# Altium schematic sheet 05_Output Connectors.SchDoc
size A3; SheetNumber: 5; SheetTotal: 14
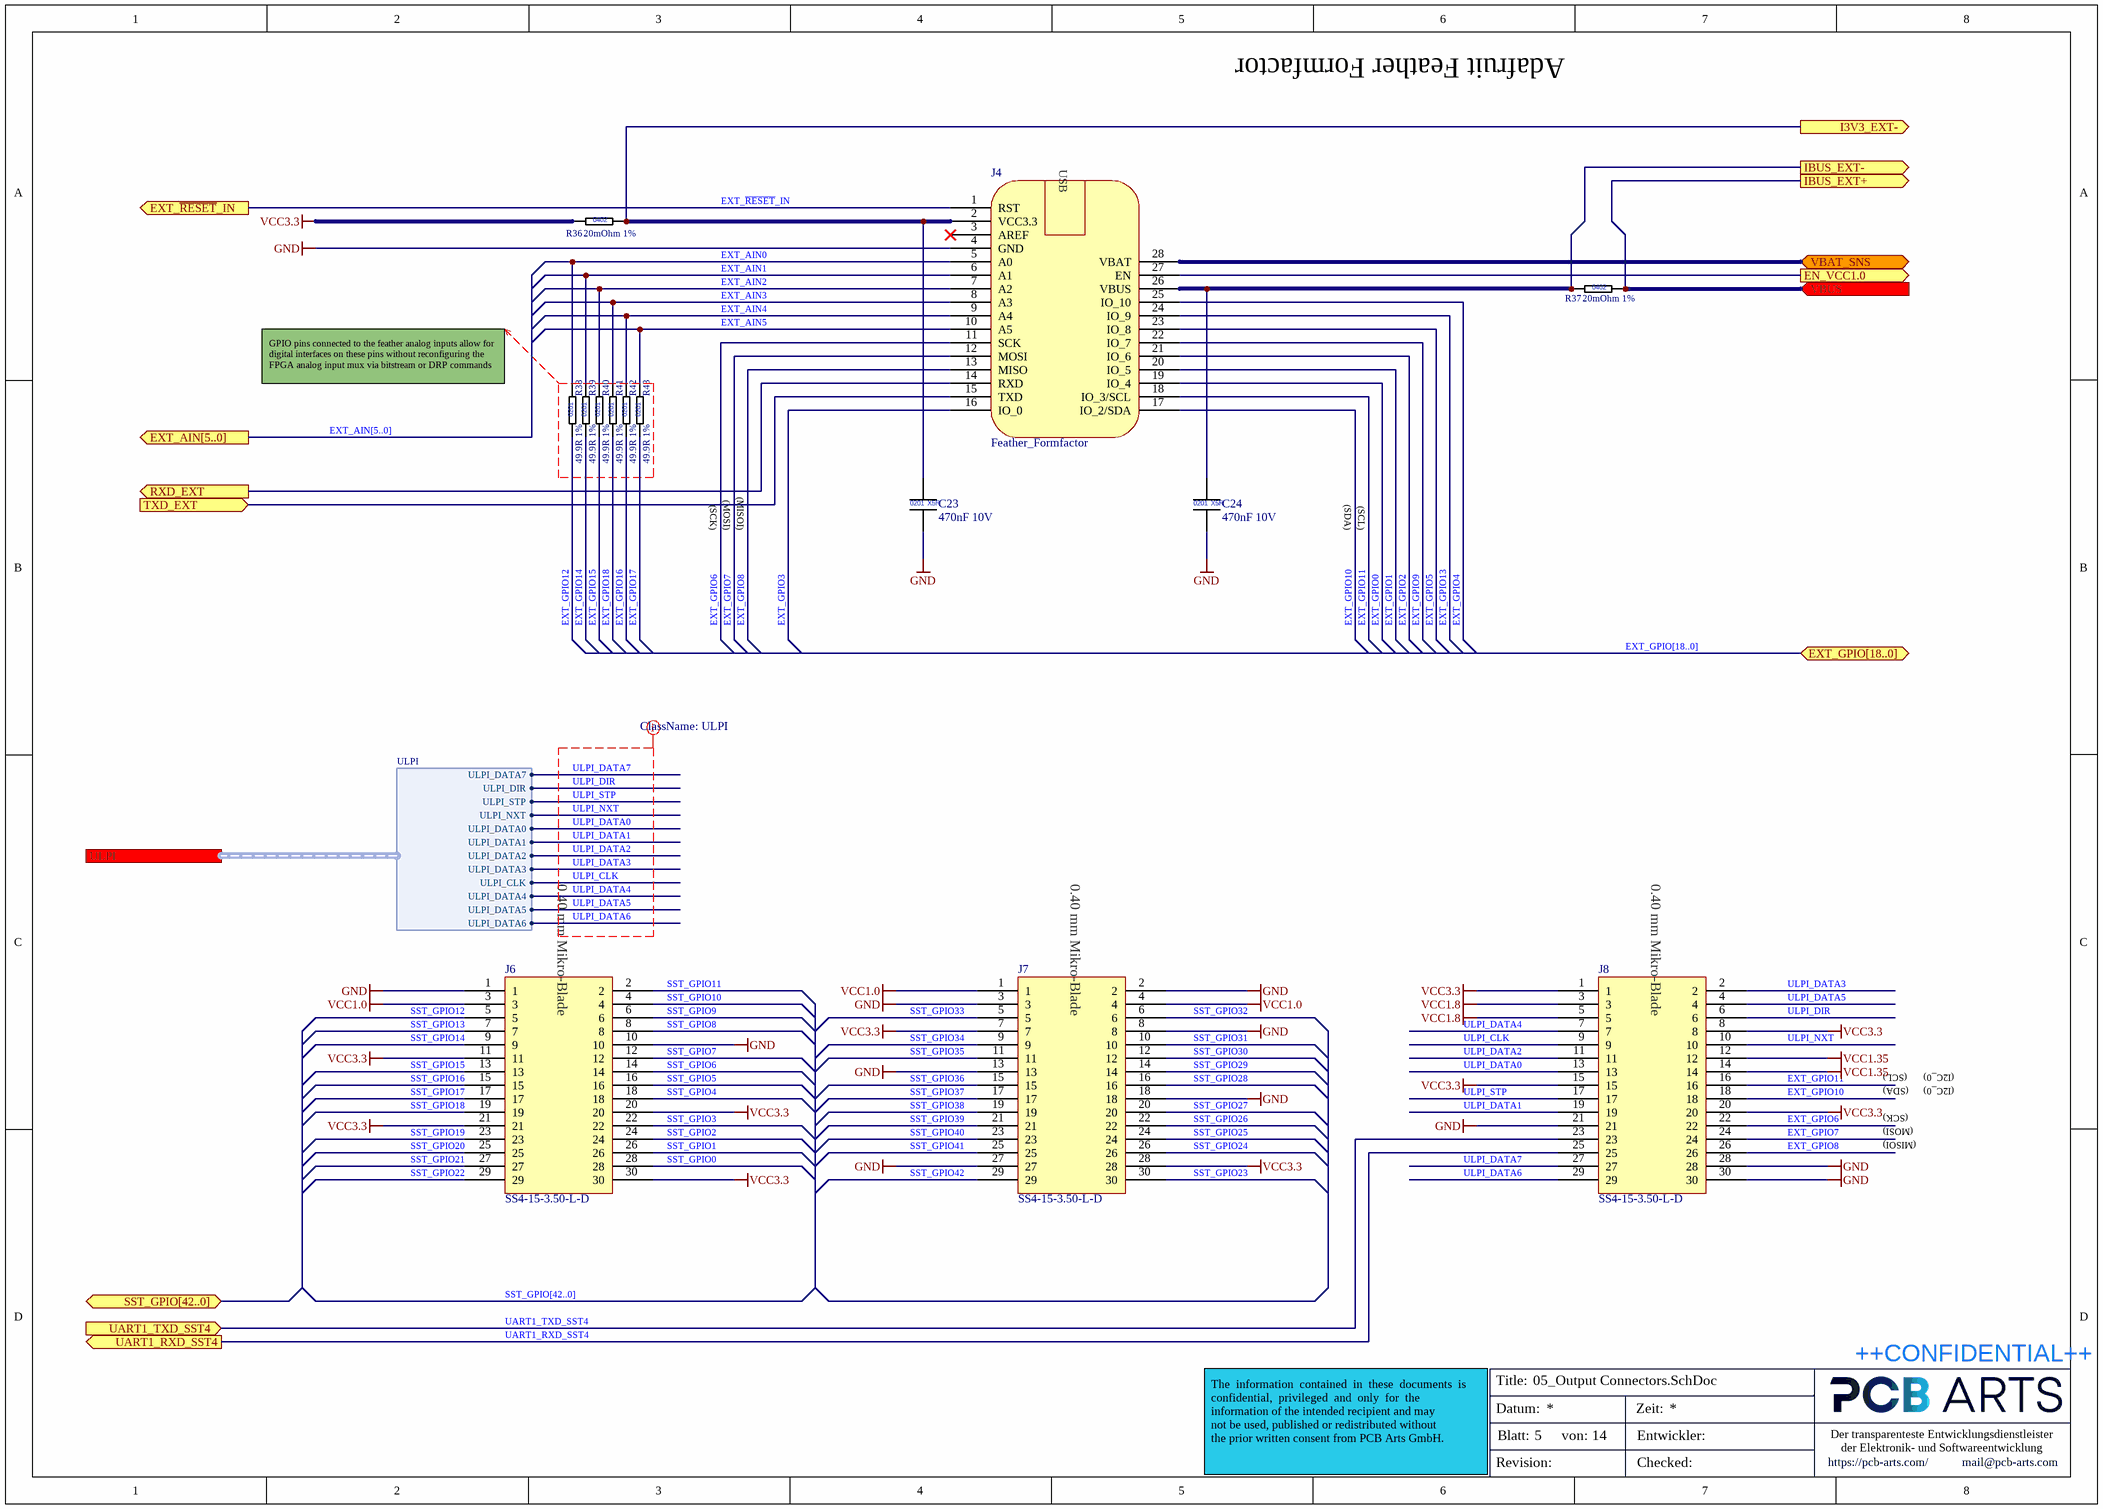
[diagram p0: 05_Output Connectors.SchDoc]

## Parts
C23  470nF 10V  [CAPC0603X03L]
C24  470nF 10V  [CAPC0603X03L]
J4  Feather_Formfactor  [Feather_FFC]  (no BOM)
J6  SS4-15-3.50-L-D  [SS4-15-3.50-L-D]
J7  SS4-15-3.50-L-D  [SS4-15-3.50-L-D]
J8  SS4-15-3.50-L-D  [SS4-15-3.50-L-D]
R36  20mOhm 1%  [RESC1005X04L]
R37  20mOhm 1%  [RESC1005X04L]
R38  49.9R 1%  [RESC0603X03L]
R39  49.9R 1%  [RESC0603X03L]
R40  49.9R 1%  [RESC0603X03L]
R41  49.9R 1%  [RESC0603X03L]
R42  49.9R 1%  [RESC0603X03L]
R43  49.9R 1%  [RESC0603X03L]

## Ports
EN_VCC1.0 (out), EXT_AIN[5..0] (out), EXT_GPIO[18..0] (bidir), EXT_~{RESET}_IN (out), I3V3_EXT- (out), IBUS_EXT+ (out), IBUS_EXT- (out), RXD_EXT (out), SST_GPIO[42..0] (bidir), TXD_EXT (in), UART1_RXD_SST4 (out), UART1_TXD_SST4 (in), ULPI (harness ULPI), VBAT_SNS (bidir), VBUS (in)

## Harnesses
ULPI: ULPI_DATA7, ULPI_DIR, ULPI_STP, ULPI_NXT, ULPI_DATA0, ULPI_DATA1, ULPI_DATA2, ULPI_DATA3, ULPI_CLK, ULPI_DATA4, ULPI_DATA5, ULPI_DATA6

## Nets
GND: C23.2 C24.2 J4.4(GND) J6.1 J6.10 J7.2 J7.3 J7.8 J7.13 J7.18 J7.27 J8.21 J8.28 J8.30
VCC1.0: J6.3 J7.1 J7.4
VCC1.8: J8.3 J8.5
VCC1.35: J8.12 J8.14
VCC3.3: J6.11 J6.20 J6.21 J6.30 J7.7 J7.28 J8.1 J8.8 J8.15 J8.20 R36.1
EN_VCC1.0: J4.27(EN) ; port EN_VCC1.0
EXT_AIN0: J4.5(A0) R38.2
EXT_AIN1: J4.6(A1) R39.2
EXT_AIN2: J4.7(A2) R40.2
EXT_AIN3: J4.8(A3) R41.2
EXT_AIN4: J4.9(A4) R42.2
EXT_AIN5: J4.10(A5) R43.2
EXT_GPIO0: J4.19(IO_4)
EXT_GPIO1: J4.20(IO_5)
EXT_GPIO2: J4.21(IO_6)
EXT_GPIO3: J4.16(IO_0)
EXT_GPIO4: J4.25(IO_10)
EXT_GPIO5: J4.23(IO_8)
EXT_GPIO6: J4.11(SCK) J8.22
EXT_GPIO7: J4.12(MOSI) J8.24
EXT_GPIO8: J4.13(MISO) J8.26
EXT_GPIO9: J4.22(IO_7)
EXT_GPIO10: J4.17(IO_2/SDA) J8.18
EXT_GPIO11: J4.18(IO_3/SCL) J8.16
EXT_GPIO12: R38.1
EXT_GPIO13: J4.24(IO_9)
EXT_GPIO14: R39.1
EXT_GPIO15: R40.1
EXT_GPIO16: R42.1
EXT_GPIO17: R43.1
EXT_GPIO18: R41.1
EXT_~{RESET}_IN: J4.1(RST) ; port EXT_~{RESET}_IN
I3V3_EXT-: C23.1 J4.2(VCC3.3) R36.2 ; port I3V3_EXT-
IBUS_EXT+: R37.2 ; port VBUS, port IBUS_EXT+
IBUS_EXT-: C24.1 J4.26(VBUS) R37.1 ; port IBUS_EXT-
RXD_EXT: J4.14(RXD) ; port RXD_EXT
SST_GPIO0: J6.28
SST_GPIO1: J6.26
SST_GPIO2: J6.24
SST_GPIO3: J6.22
SST_GPIO4: J6.18
SST_GPIO5: J6.16
SST_GPIO6: J6.14
SST_GPIO7: J6.12
SST_GPIO8: J6.8
SST_GPIO9: J6.6
SST_GPIO10: J6.4
SST_GPIO11: J6.2
SST_GPIO12: J6.5
SST_GPIO13: J6.7
SST_GPIO14: J6.9
SST_GPIO15: J6.13
SST_GPIO16: J6.15
SST_GPIO17: J6.17
SST_GPIO18: J6.19
SST_GPIO19: J6.23
SST_GPIO20: J6.25
SST_GPIO21: J6.27
SST_GPIO22: J6.29
SST_GPIO23: J7.30
SST_GPIO24: J7.26
SST_GPIO25: J7.24
SST_GPIO26: J7.22
SST_GPIO27: J7.20
SST_GPIO28: J7.16
SST_GPIO29: J7.14
SST_GPIO30: J7.12
SST_GPIO31: J7.10
SST_GPIO32: J7.6
SST_GPIO33: J7.5
SST_GPIO34: J7.9
SST_GPIO35: J7.11
SST_GPIO36: J7.15
SST_GPIO37: J7.17
SST_GPIO38: J7.19
SST_GPIO39: J7.21
SST_GPIO40: J7.23
SST_GPIO41: J7.25
SST_GPIO42: J7.29
TXD_EXT: J4.15(TXD) ; port TXD_EXT
UART1_RXD_SST4: J8.25 ; port UART1_RXD_SST4
UART1_TXD_SST4: J8.23 ; port UART1_TXD_SST4
ULPI_CLK: J8.9 ; port ULPI.ULPI_CLK
ULPI_DATA0: J8.13 ; port ULPI.ULPI_DATA0
ULPI_DATA1: J8.19 ; port ULPI.ULPI_DATA1
ULPI_DATA2: J8.11 ; port ULPI.ULPI_DATA2
ULPI_DATA3: J8.2 ; port ULPI.ULPI_DATA3
ULPI_DATA4: J8.7 ; port ULPI.ULPI_DATA4
ULPI_DATA5: J8.4 ; port ULPI.ULPI_DATA5
ULPI_DATA6: J8.29 ; port ULPI.ULPI_DATA6
ULPI_DATA7: J8.27 ; port ULPI.ULPI_DATA7
ULPI_DIR: J8.6 ; port ULPI.ULPI_DIR
ULPI_NXT: J8.10 ; port ULPI.ULPI_NXT
ULPI_STP: J8.17 ; port ULPI.ULPI_STP
VBAT_SNS: J4.28(VBAT) ; port VBAT_SNS

Not connected (* = marked no-connect by the designer): J4 3(AREF)*

## Buses and harness runs
bus EXT_AIN[5..0] = port EXT_AIN[5..0]
bus EXT_GPIO[18..0] = port EXT_GPIO[18..0]
bus SST_GPIO[42..0] = port SST_GPIO[42..0]

## Layout directives
net class ULPI: ULPI_CLK, ULPI_DATA0, ULPI_DATA1, ULPI_DATA2, ULPI_DATA3, ULPI_DATA4, ULPI_DATA5, ULPI_DATA6, ULPI_DATA7, ULPI_DIR, ULPI_NXT, ULPI_STP

## Notes on the sheet
- Adafruit Feather Formfactor
- GPIO pins connected to the feather analog inputs allow for digital interfaces on these pins without reconfiguring the FPGA analog input mux via bitstream or DRP commands
- (SCK)
- (MOSI)
- (MISOI)
- (SDA)
- (SCL)
- (I2C_0)
- Title:
- ++CONFIDENTIAL++
- Datum:
- Blatt:
- von:
- Zeit:
- Entwickler:
- Der transparenteste Entwicklungsdienstleister
  der Elektronik- und Softwareentwicklung
- The  information  contained  in  these  documents  is  confidential,  privileged  and  only  for  the
  information of the intended recipient and may
  not be used, published or redistributed without
  the prior written consent from PCB Arts GmbH.
- Revision:
- Checked:
- https://pcb-arts.com/
- mail@pcb-arts.com
- (in symbol CAP_0201_470nF_10V) 0201; X5R
- (in symbol Feather_Formfactor) USB
- (in symbol RES_0201_49.9R_1%) 0201
- (in symbol RES_0402_20mR_1%) 0402
- (in symbol SS4-15-3.50-L-D_0.40 mm Mikro-Blade & Beam) 0.40 mm Mikro-Blade

## Library data of the parts
C23 C24 = CAP_0201_470nF_10V: Multilayer Ceramic Capacitors MLCC - SMD/SMT 0201 10VDC; Manufacturer 1: Taiyo Yuden; Manufacturer 1 Prt. Nr.: LMK063BBJ474KPLF; Manufacturer 2 Prt. Nr.: C0603X5R1A474M030BC; Manufacturer 2: TDK
J6-J8 = SS4-15-3.50-L-D_0.40 mm Mikro-Blade & Beam: 0.40 mm Mikro-Blade & Beam ultrafeine Raster-Stiftleiste; Manufacturer 1: Samtec; Manufacturer 1 Prt. Nr.: SS4-15-3.50-L-D
R36 R37 = RES_0402_20mR_1%: Thick Film Resistors - SMD 20mOHM 1%; Manufacturer 1: Yageo; Manufacturer 1 Prt. Nr.: PA0402FRL7T0R02L
R38-R43 = RES_0201_49.9R_1%: Thick Film Resistors - SMD 49.9R OHM 1%; Manufacturer 1: Yageo; Manufacturer 1 Prt. Nr.: AC0201FR-0749R9L; Manufacturer 2 Prt. Nr.: CRCW020149R9FNED; Manufacturer 2: Vishay / Dale